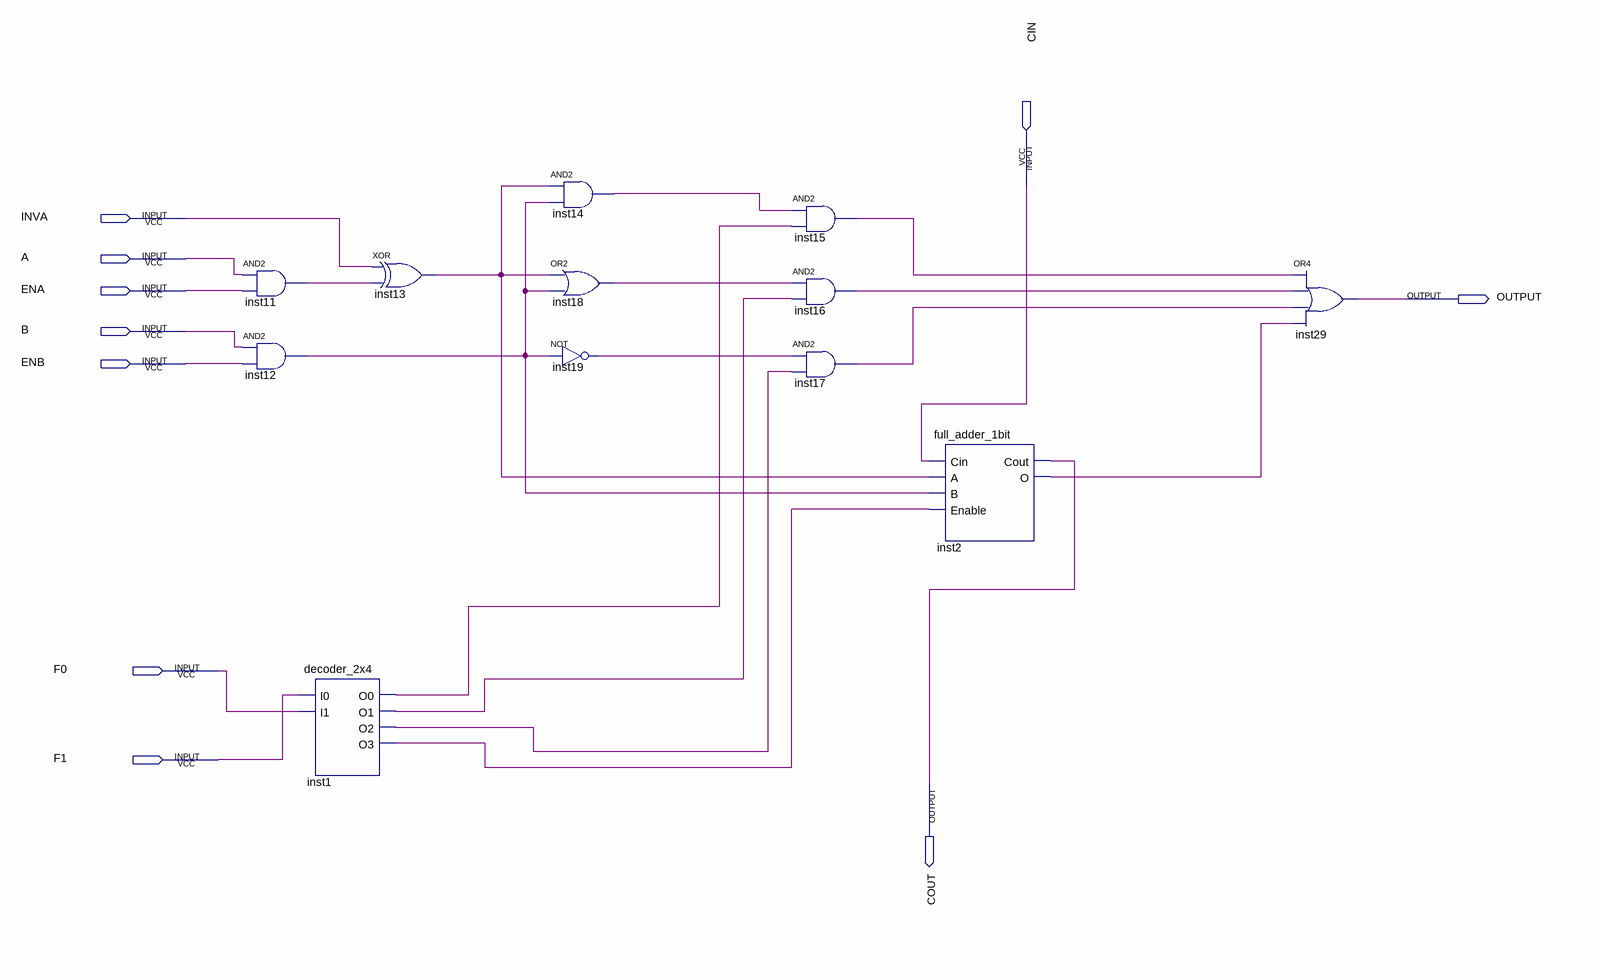
[diagram p0: schematic sheet]
// Quartus schematic ULA_1bit.bdf as structural Verilog: 12 symbols, 10 pins
module ULA_1bit (
  input  CIN,
  input  INVA,
  input  A,
  input  ENA,
  input  B,
  input  ENB,
  input  F0,
  input  F1,
  output OUTPUT,
  output COUT
);

  wire inst1_o0, inst1_o1, inst1_o2, inst1_o3, inst2_o, inst11_out, inst12_out, inst13_out, inst14_out,
       inst15_out, inst16_out, inst17_out, inst18_out, inst19_out;

  and inst11 (inst11_out, A, ENA);
  and inst12 (inst12_out, B, ENB);
  decoder_2x4 inst1 (.I0(F1), .I1(F0), .O0(inst1_o0), .O1(inst1_o1), .O2(inst1_o2), .O3(inst1_o3));
  xor inst13 (inst13_out, INVA, inst11_out);
  and inst14 (inst14_out, inst13_out, inst12_out);
  or inst18 (inst18_out, inst13_out, inst12_out);
  not inst19 (inst19_out, inst12_out);
  and inst15 (inst15_out, inst14_out, inst1_o0);
  and inst16 (inst16_out, inst18_out, inst1_o1);
  and inst17 (inst17_out, inst19_out, inst1_o2);
  full_adder_1bit inst2 (.Cin(CIN), .A(inst13_out), .B(inst12_out), .Enable(inst1_o3), .Cout(COUT), .O(inst2_o));
  or inst29 (OUTPUT, inst15_out, inst16_out, inst17_out, inst2_o);
endmodule
